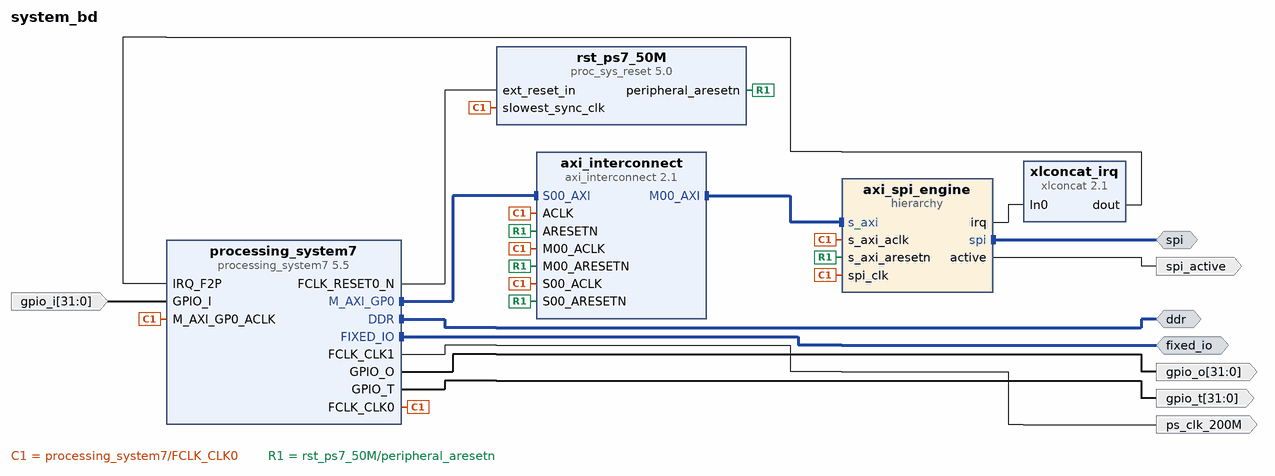
[diagram p0: block diagram of the top level]
# Vivado block design system_bd, xc7z045ffg900-2, Vivado 2024.1
create_bd_design system_bd

create_bd_intf_port -mode Master -vlnv xilinx.com:interface:ddrx_rtl:1.0 ddr
create_bd_intf_port -mode Master -vlnv xilinx.com:display_processing_system7:fixedio_rtl:1.0 fixed_io
create_bd_intf_port -mode Master -vlnv analog.com:interface:spi_master_rtl:1.0 spi
create_bd_port -dir O spi_active
create_bd_port -dir O -type clk ps_clk_200M
set_property -dict {CONFIG.FREQ_HZ 200000000} [get_bd_ports ps_clk_200M]
create_bd_port -dir I -from 31 -to 0 gpio_i
create_bd_port -dir O -from 31 -to 0 gpio_o
create_bd_port -dir O -from 31 -to 0 gpio_t

create_bd_cell -type ip -vlnv xilinx.com:ip:processing_system7:5.5 processing_system7
set_property -dict [list \
  CONFIG.PCW_APU_PERIPHERAL_FREQMHZ 667.000000 \
  CONFIG.PCW_DUAL_PARALLEL_QSPI_DATA_MODE x8 \
  CONFIG.PCW_ENET0_ENET0_IO {MIO 16 .. 27} \
  CONFIG.PCW_ENET0_GRP_MDIO_ENABLE 1 \
  CONFIG.PCW_ENET0_GRP_MDIO_IO {MIO 52 .. 53} \
  CONFIG.PCW_ENET0_PERIPHERAL_ENABLE 1 \
  CONFIG.PCW_ENET0_PERIPHERAL_FREQMHZ {100 Mbps} \
  CONFIG.PCW_ENET0_RESET_ENABLE 1 \
  CONFIG.PCW_ENET0_RESET_IO {MIO 47} \
  CONFIG.PCW_ENET_RESET_ENABLE 1 \
  CONFIG.PCW_ENET_RESET_SELECT {Share reset pin} \
  CONFIG.PCW_EN_CLK1_PORT 1 \
  CONFIG.PCW_FCLK_CLK1_BUF TRUE \
  CONFIG.PCW_FPGA1_PERIPHERAL_FREQMHZ 200 \
  CONFIG.PCW_FPGA_FCLK1_ENABLE 1 \
  CONFIG.PCW_GPIO_EMIO_GPIO_ENABLE 1 \
  CONFIG.PCW_GPIO_EMIO_GPIO_IO 32 \
  CONFIG.PCW_GPIO_EMIO_GPIO_WIDTH 32 \
  CONFIG.PCW_GPIO_MIO_GPIO_ENABLE 1 \
  CONFIG.PCW_GPIO_MIO_GPIO_IO MIO \
  CONFIG.PCW_I2C0_GRP_INT_ENABLE 0 \
  CONFIG.PCW_I2C0_I2C0_IO {MIO 50 .. 51} \
  CONFIG.PCW_I2C0_PERIPHERAL_ENABLE 1 \
  CONFIG.PCW_I2C0_RESET_ENABLE 1 \
  CONFIG.PCW_I2C0_RESET_IO {MIO 46} \
  CONFIG.PCW_I2C_PERIPHERAL_FREQMHZ 111.111115 \
  CONFIG.PCW_I2C_RESET_ENABLE 1 \
  CONFIG.PCW_I2C_RESET_SELECT {Share reset pin} \
  CONFIG.PCW_IRQ_F2P_INTR 1 \
  CONFIG.PCW_PRESET_BANK0_VOLTAGE {LVCMOS 1.8V} \
  CONFIG.PCW_PRESET_BANK1_VOLTAGE {LVCMOS 1.8V} \
  CONFIG.PCW_QSPI_GRP_FBCLK_ENABLE 1 \
  CONFIG.PCW_QSPI_GRP_FBCLK_IO {MIO 8} \
  CONFIG.PCW_QSPI_GRP_IO1_ENABLE 1 \
  CONFIG.PCW_QSPI_GRP_IO1_IO {MIO 0 9 .. 13} \
  CONFIG.PCW_QSPI_GRP_SINGLE_SS_ENABLE 0 \
  CONFIG.PCW_QSPI_INTERNAL_HIGHADDRESS 0xFDFFFFFF \
  CONFIG.PCW_QSPI_PERIPHERAL_ENABLE 1 \
  CONFIG.PCW_QSPI_QSPI_IO {MIO 1 .. 6} \
  CONFIG.PCW_SD0_GRP_CD_ENABLE 1 \
  CONFIG.PCW_SD0_GRP_CD_IO {MIO 14} \
  CONFIG.PCW_SD0_GRP_WP_ENABLE 1 \
  CONFIG.PCW_SD0_GRP_WP_IO {MIO 15} \
  CONFIG.PCW_SD0_PERIPHERAL_ENABLE 1 \
  CONFIG.PCW_SD0_SD0_IO {MIO 40 .. 45} \
  CONFIG.PCW_SDIO_PERIPHERAL_FREQMHZ 50 \
  CONFIG.PCW_TTC0_PERIPHERAL_ENABLE 1 \
  CONFIG.PCW_TTC0_TTC0_IO EMIO \
  CONFIG.PCW_UART1_PERIPHERAL_ENABLE 1 \
  CONFIG.PCW_UART1_UART1_IO {MIO 48 .. 49} \
  CONFIG.PCW_UART_PERIPHERAL_FREQMHZ 50 \
  CONFIG.PCW_UIPARAM_DDR_FREQ_MHZ 533.333313 \
  CONFIG.PCW_UIPARAM_DDR_PARTNO Custom \
  CONFIG.PCW_USB0_PERIPHERAL_ENABLE 1 \
  CONFIG.PCW_USB0_RESET_ENABLE 1 \
  CONFIG.PCW_USB0_RESET_IO {MIO 7} \
  CONFIG.PCW_USB0_USB0_IO {MIO 28 .. 39} \
  CONFIG.PCW_USB_RESET_ENABLE 1 \
  CONFIG.PCW_USB_RESET_SELECT {Share reset pin} \
  CONFIG.PCW_USE_FABRIC_INTERRUPT 1 \
  CONFIG.preset ZC706 \
] [get_bd_cells processing_system7]
# 235 more settings of processing_system7 are not shown: defaults, MIO pin electricals, DDR timing, and values the tool derives
create_bd_cell -type hier axi_spi_engine
create_bd_cell -type ip -vlnv xilinx.com:ip:proc_sys_reset:5.0 rst_ps7_50M
create_bd_cell -type ip -vlnv xilinx.com:ip:axi_interconnect:2.1 axi_interconnect
set_property -dict {CONFIG.NUM_MI 1} [get_bd_cells axi_interconnect]
create_bd_cell -type ip -vlnv xilinx.com:ip:xlconcat:2.1 xlconcat_irq
set_property -dict {CONFIG.NUM_PORTS 1 CONFIG.dout_width 1} [get_bd_cells xlconcat_irq]

# ---- hierarchy /axi_spi_engine ----
current_bd_instance /axi_spi_engine
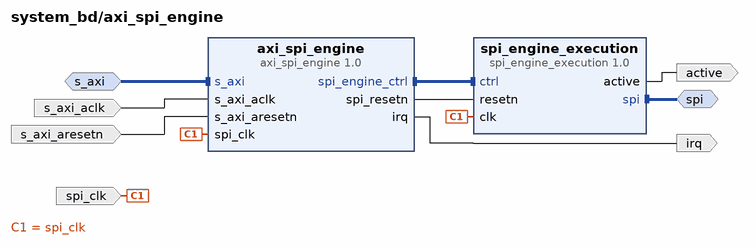
[diagram p1: block diagram inside /axi_spi_engine]
create_bd_intf_pin -mode Slave -vlnv xilinx.com:interface:aximm_rtl:1.0 s_axi
create_bd_intf_pin -mode Master -vlnv analog.com:interface:spi_master_rtl:1.0 spi
create_bd_pin -dir I -type clk s_axi_aclk
create_bd_pin -dir I -type rst s_axi_aresetn
create_bd_pin -dir I -type clk spi_clk
create_bd_pin -dir O active
create_bd_pin -dir O irq

create_bd_cell -type ip -vlnv analog.com:user:axi_spi_engine:1.0 axi_spi_engine
create_bd_cell -type ip -vlnv analog.com:user:spi_engine_execution:1.0 spi_engine_execution

# ---- connections ----

current_bd_instance /axi_spi_engine
connect_bd_intf_net [get_bd_intf_pins s_axi] [get_bd_intf_pins axi_spi_engine/s_axi]
connect_bd_intf_net [get_bd_intf_pins spi] [get_bd_intf_pins spi_engine_execution/spi]
connect_bd_intf_net [get_bd_intf_pins axi_spi_engine/spi_engine_ctrl] [get_bd_intf_pins spi_engine_execution/ctrl]
connect_bd_net [get_bd_pins axi_spi_engine/irq] [get_bd_pins irq]
connect_bd_net [get_bd_pins axi_spi_engine/spi_resetn] [get_bd_pins spi_engine_execution/resetn]
connect_bd_net -net s_axi_aclk_0_1 [get_bd_pins s_axi_aclk] [get_bd_pins axi_spi_engine/s_axi_aclk]
connect_bd_net -net s_axi_aresetn_0_1 [get_bd_pins s_axi_aresetn] [get_bd_pins axi_spi_engine/s_axi_aresetn]
connect_bd_net -net spi_clk_0_1 [get_bd_pins spi_clk] [get_bd_pins axi_spi_engine/spi_clk] [get_bd_pins spi_engine_execution/clk]
connect_bd_net [get_bd_pins spi_engine_execution/active] [get_bd_pins active]

current_bd_instance /
connect_bd_intf_net -intf_net axi_interconnect_0_M00_AXI [get_bd_intf_pins axi_interconnect/M00_AXI] [get_bd_intf_pins axi_spi_engine/s_axi]
connect_bd_intf_net [get_bd_intf_ports spi] [get_bd_intf_pins axi_spi_engine/spi]
connect_bd_intf_net [get_bd_intf_ports ddr] [get_bd_intf_pins processing_system7/DDR]
connect_bd_intf_net [get_bd_intf_ports fixed_io] [get_bd_intf_pins processing_system7/FIXED_IO]
connect_bd_intf_net [get_bd_intf_pins processing_system7/M_AXI_GP0] [get_bd_intf_pins axi_interconnect/S00_AXI]
connect_bd_net -net GPIO_I_0_1 [get_bd_ports gpio_i] [get_bd_pins processing_system7/GPIO_I]
connect_bd_net [get_bd_pins axi_spi_engine/active] [get_bd_ports spi_active]
connect_bd_net [get_bd_pins axi_spi_engine/irq] [get_bd_pins xlconcat_irq/In0]
connect_bd_net [get_bd_pins processing_system7/FCLK_CLK0] \
  [get_bd_pins processing_system7/M_AXI_GP0_ACLK] [get_bd_pins axi_spi_engine/s_axi_aclk] \
  [get_bd_pins axi_spi_engine/spi_clk] [get_bd_pins axi_interconnect/ACLK] [get_bd_pins axi_interconnect/S00_ACLK] \
  [get_bd_pins axi_interconnect/M00_ACLK] [get_bd_pins rst_ps7_50M/slowest_sync_clk]
connect_bd_net [get_bd_pins processing_system7/FCLK_CLK1] [get_bd_ports ps_clk_200M]
connect_bd_net [get_bd_pins processing_system7/FCLK_RESET0_N] [get_bd_pins rst_ps7_50M/ext_reset_in]
connect_bd_net [get_bd_pins processing_system7/GPIO_O] [get_bd_ports gpio_o]
connect_bd_net [get_bd_pins processing_system7/GPIO_T] [get_bd_ports gpio_t]
connect_bd_net [get_bd_pins rst_ps7_50M/peripheral_aresetn] \
  [get_bd_pins axi_spi_engine/s_axi_aresetn] [get_bd_pins axi_interconnect/ARESETN] \
  [get_bd_pins axi_interconnect/S00_ARESETN] [get_bd_pins axi_interconnect/M00_ARESETN]
connect_bd_net [get_bd_pins xlconcat_irq/dout] [get_bd_pins processing_system7/IRQ_F2P]

# ---- address map ----
assign_bd_address -offset 0x43C00000 -range 64K -target_address_space [get_bd_addr_spaces processing_system7/Data] [get_bd_addr_segs axi_spi_engine/axi_spi_engine/s_axi/axi_lite]

validate_bd_design
save_bd_design
